# Altium schematic sheet EPS.SchDoc: EPS
size A4; Revision: 1.0; SheetNumber: 1; SheetTotal: 1; Class: A
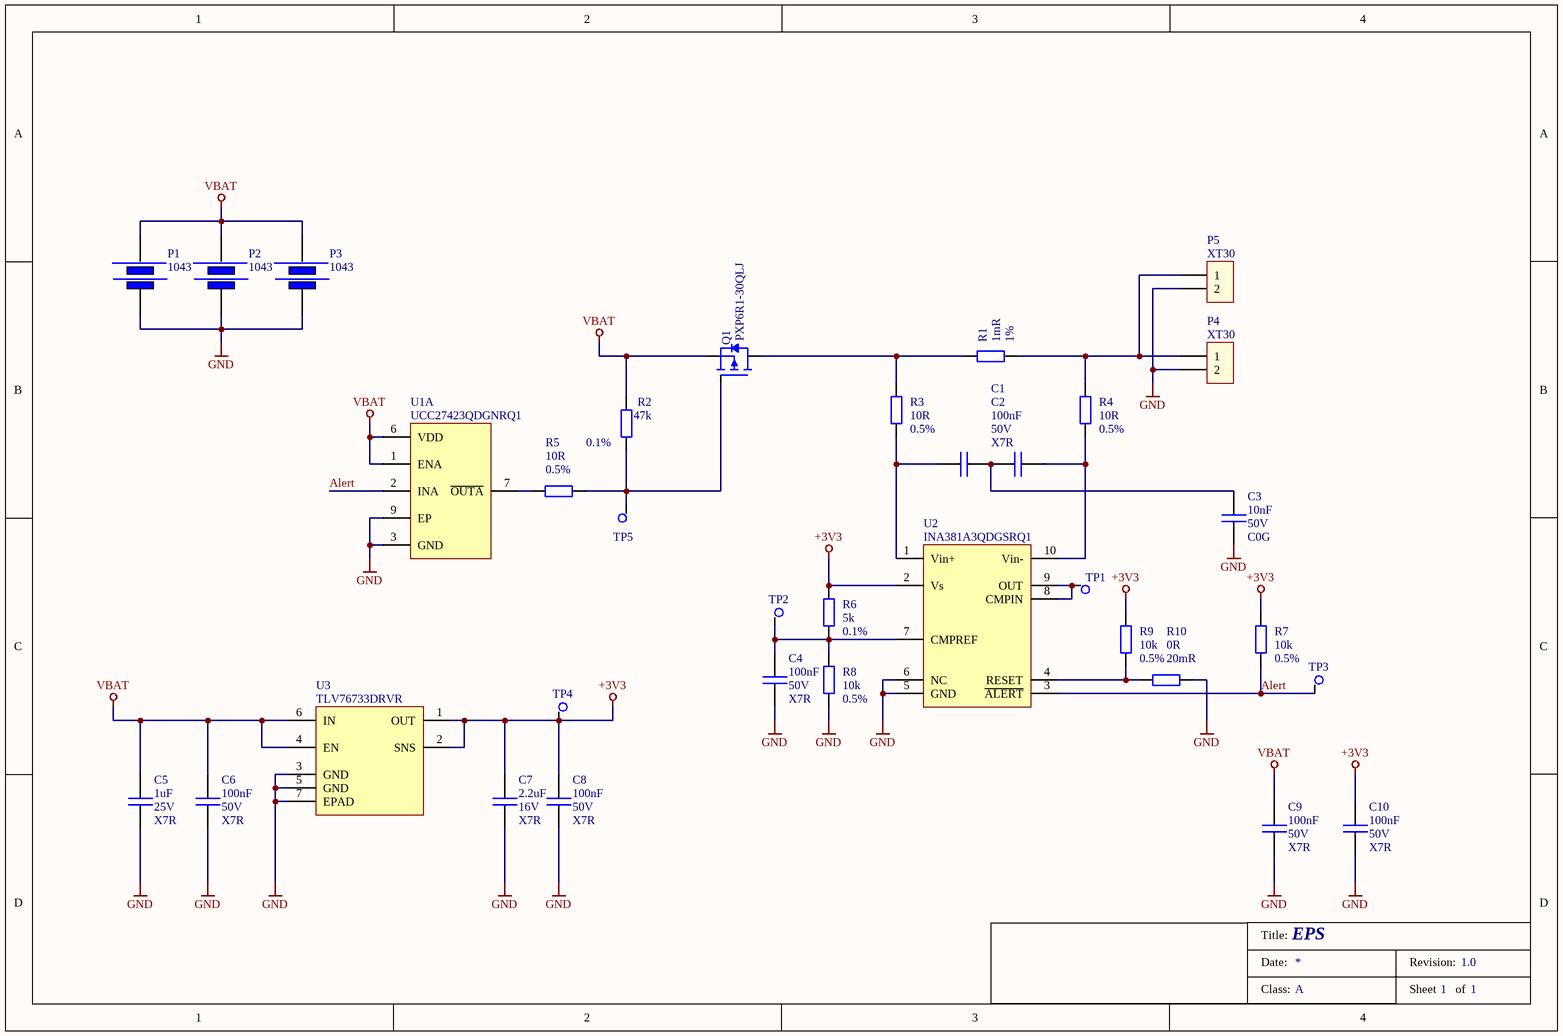
[diagram p0: EPS.SchDoc]

## Parts
C1  C  [C_0603]  (value not drawn)
C2  value 100nF  Voltage: 50V  Dielectric: X7R  [C_0603]  (hidden comment: C)
C3  value 10nF  Voltage: 50V  Dielectric: C0G  [C_0603]  (hidden comment: C)
C4  value 100nF  Voltage: 50V  Dielectric: X7R  [C_0603]  (hidden comment: C)
C5  value 1uF  Voltage: 25V  Dielectric: X7R  [C_0603]  (hidden comment: C)
C6  value 100nF  Voltage: 50V  Dielectric: X7R  [C_0603]  (hidden comment: C)
C7  value 2.2uF  Voltage: 16V  Dielectric: X7R  [C_0805]  (hidden comment: C)
C8  value 100nF  Voltage: 50V  Dielectric: X7R  [C_0603]  (hidden comment: C)
C9  value 100nF  Voltage: 50V  Dielectric: X7R  [C_0603]  (hidden comment: C)
C10  value 100nF  Voltage: 50V  Dielectric: X7R  [C_0603]  (hidden comment: C)
P1  value 1043  [B_1043]  (hidden comment: P_BATT)
P2  value 1043  [B_1043]  (hidden comment: P_BATT)
P3  value 1043  [B_1043]  (hidden comment: P_BATT)
P4  P_Header_2  [XT30]  (value not drawn)
P5  P_Header_2  [XT30]  (value not drawn)
Q1  value PXP6R1-30QLJ  [WDFN_8]  (hidden comment: Q_PMOSFET)
R1  value 1mR  Tolerance: 1%  [R_1206]  (hidden comment: R)
R2  value 47k  Tolerance: 0.1%  [R_0402]  (hidden comment: R)
R3  value 10R  Tolerance: 0.5%  [R_0603]  (hidden comment: R)
R4  value 10R  Tolerance: 0.5%  [R_0603]  (hidden comment: R)
R5  value 10R  Tolerance: 0.5%  [R_0603]  (hidden comment: R)
R6  value 5k  Tolerance: 0.1%  [R_0603]  (hidden comment: R)
R7  value 10k  Tolerance: 0.5%  [R_0603]  (hidden comment: R)
R8  value 10k  Tolerance: 0.5%  [R_0603]  (hidden comment: R)
R9  value 10k  Tolerance: 0.5%  [R_0603]  (hidden comment: R)
R10  value 0R  Tolerance: 20mR  [R_0603]  (hidden comment: R)
TP1  TP_TestPoint  [TP_01]  (value not drawn)
TP2  TP_TestPoint  [TP_01]  (value not drawn)
TP3  TP_TestPoint  [TP_01]  (value not drawn)
TP4  TP_TestPoint  [TP_01]  (value not drawn)
TP5  TP_TestPoint  [TP_01]  (value not drawn)
U1  value UCC27423QDGNRQ1  [MSOP_8]  (hidden comment: IC_UCC27423_Q1)  (part A of 2)
U2  value INA381A3QDGSRQ1  [VSSOP_10]  (hidden comment: IC_INA381_Q1)
U3  =Value: TLV76733DRVR  [WSON_6]  (hidden comment: IC_TLV76733DRVR)

## Nets
+3V3: C7.1 C8.1 C10.1 R6.1 R7.1 R9.1 TP4.1 U2.2(Vs) U3.1(OUT) U3.2(SNS)
GND: C3.2 C4.2 C5.2 C6.2 C7.2 C8.2 C9.2 C10.2 P1.2 P2.2 P3.2 P4.2 P5.2 R8.2 R10.2 U1.3(GND) U1.9(EP) U2.5(GND) U2.6(NC) U3.3(GND) U3.5(GND) U3.7(EPAD)
VBAT: C5.1 C6.1 C9.1 P1.1 P2.1 P3.1 Q1.2(S) R2.1 U1.1(ENA) U1.6(VDD) U3.4(EN) U3.6(IN)
Alert: R7.2 TP3.1 U1.2(INA) U2.3(~{ALERT})
NetC1_1: C1.1 C2.2 C3.1
NetC1_2: C1.2 R4.2 U2.10(Vin-)
NetC2_1: C2.1 R3.2 U2.1(Vin+)
NetC4_1: C4.1 R6.2 R8.1 TP2.1 U2.7(CMPREF)
NetP4_1: P4.1 P5.1 R1.2 R4.1
NetQ1_1: Q1.1(G) R2.2 R5.2 TP5.1
NetQ1_3: Q1.3(D) R1.1 R3.1
NetR5_1: R5.1 U1.7(~{OUTA})
NetR9_2: R9.2 R10.1 U2.4(RESET)
NetTP1_1: TP1.1 U2.8(CMPIN) U2.9(OUT)

## Notes on the sheet
- Title:
- Date:
- Revision:
- Class:
- Sheet
- of

## Library data of the parts
C1 = C_100nF_50V_0603: Capacitor; Manufacturer: Kemet; Manufacturer Part Number: C0603T104K5RCL7136; Voltage: 50V; Dielectric: X7R; Value: 100nF; Tmax: 125; Tmin: -55; Grade: 2; Fail Rate: A; Tolerance: 10%; Part Number: C_100nF_50V_0603; HelpURL: https://content.kemet.com/datasheets/KEM_C1027_X7R_COTS_SMD.pdf; Supplier 1: Digi-Key; Supplier Part Number 1: 399-6305-1-ND; Status: Active
C2 C4 C6 C8-C10 = C_100nF_50V_0603: Capacitor; Manufacturer: Kemet; Manufacturer Part Number: C0603T104K5RCL7136; Tmax: 125; Tmin: -55; Grade: 2; Fail Rate: A; Tolerance: 10%; Part Number: C_100nF_50V_0603; HelpURL: https://content.kemet.com/datasheets/KEM_C1027_X7R_COTS_SMD.pdf; Supplier 1: Digi-Key; Supplier Part Number 1: 399-6305-1-ND; Status: Active
C3 = C_10nF_50V_0603: Capacitor; Manufacturer: Kemet; Manufacturer Part Number: C0603T103J5RAC7867; Tmax: 125; Tmin: -55; Grade: 2; Fail Rate: A; Tolerance: 5%; Part Number: C_10nF_50V_0603; HelpURL: https://content.kemet.com/datasheets/KEM_C1027_X7R_COTS_SMD.pdf; Supplier 1: Digi-Key; Supplier Part Number 1: 399-20387-1-ND; Status: Active
C5 = C_1uF_25V_0603: Capacitor; Manufacturer: Murata; Manufacturer Part Number: C0603T222K5RAC7867 / GCJ188R71E105KA01D; Tmax: 125; Tmin: -55; Grade: 2; Fail Rate: A; Tolerance: 10%; Part Number: C_1uF_25V_0603; HelpURL: https://www.murata.com/en-eu/api/pdfdownloadapi?cate=luCeramicCapacitorsSMD&partno=GCJ188R71E105KA01%23; Supplier 1: Mouser; Supplier Part Number 1: 81-GCJ188R71E105KA1D; Status: Active
C7 = C_2.2uF_16V_0805: Capacitor; Manufacturer: Kemet; Manufacturer Part Number: C0805T225K4RAL7800; Tmax: 125; Tmin: -55; Grade: 2; Fail Rate: A; Tolerance: 10%; Part Number: C_2.2uF_16V_0805; HelpURL: https://content.kemet.com/datasheets/KEM_C1027_X7R_COTS_SMD.pdf; Supplier 1: Digi-Key; Supplier Part Number 1: 399-17975-6-ND; Status: Active
P1-P3 = 18650_Holder_1043: 1043; Manufacturer: Keystone Electronics; Grade: 3; Part Number: 18650_Holder_1043; HelpURL: https://www.keyelco.com/userAssets/file/M65p27.pdf; Manufacturer Part Number: 1043; Supplier 1: Mouser; Supplier Part Number 1: 534-1043; Status: Active
P4 P5 = XT30: Manufacturer: DFRobot; Manufacturer Part Number: FIT0586; Grade: 3; Value: XT30; Desc: XT30; Part Number: XT30; HelpURL: https://media.digikey.com/pdf/Data%20Sheets/DFRobot%20PDFs/FIT0586_Web.pdf; Supplier 1: DigiKey; Supplier Part Number 1: 1738-1436-ND; Status: Active
Q1 = PXP6R1-30QLJ: Low Vgs Single P-Channel; Manufacturer: NEXPERIA; Max Power Dissipation: 50W; Tmax: 150; Tmin: -55; Grade: 2; Part Number: PXP6R1-30QLJ; HelpURL: https://assets.nexperia.com/documents/data-sheet/PXP6R1-30QL.pdf; Manufacturer Part Number: PXP6R1-30QLJ; Supplier 1: Mouser; Supplier Part Number 1: 771-PXP6R1-30QLJ; Status: Active
R1 = R_1mR_NA_1206: Manufacturer: TT Electronics; Manufacturer Part Number: ULRG1-1206-R001-F-LF-SLT / ULRG1-1206-R001-F-LF-SLT; Voltage: NA; RMS Power: 1W; TCR: 50ppm; Tmax: 170; Tmin: -55; Grade: 2; Part Number: R_1mR_NA_1206; HelpURL: https://www.ttelectronics.com/TTElectronics/media/ProductFiles/Datasheets/ULR.pdf; Supplier 1: Mouser; Supplier Part Number 1: 66-ULRG1-1206-R001F; Status: Active
R2 = R_47k_50V_0402: Manufacturer: Vishay; Manufacturer Part Number: MCS0402MD4702BE100; Voltage: 50V; RMS Power: 0.1W; TCR: 25ppm; Tmax: 155; Tmin: -55; Grade: 2; Part Number: R_47k_50V_0402; HelpURL: https://www.vishay.com/docs/28785/mcat_pre.pdf; Supplier 2: Mouser; Supplier Part Number 2: 594-MCS0402MD4702BE1; Supplier 1: Digi-Key; Supplier Part Number 1: MCS0402-47.0K-MBCT-ND; Status: Active
R3-R5 = R_10R_75V_0603: Manufacturer: Vishay; Manufacturer Part Number: MCT0603PD1009DP500; Voltage: 75V; RMS Power: 0.25W; TCR: 25ppm; Tmax: 175; Tmin: -55; Grade: 2; Part Number: R_10R_75V_0603; HelpURL: https://www.vishay.com/docs/28916/mcxhp.pdf; Supplier 2: Mouser; Supplier Part Number 2: 594-MCT0603PD1009DP5; Supplier 1: Digi-Key; Supplier Part Number 1: 749-1520-1-ND; Status: Active
R6 = R_5k_75V_0603: Manufacturer: YAGEO; Manufacturer Part Number: RT0603BRE075KL; Voltage: 75V; RMS Power: 0.1W; TCR: 50ppm; Tmax: 155; Tmin: -55; Grade: 2; Part Number: R_5k_75V_0603; HelpURL: https://www.yageo.com/upload/media/product/productsearch/datasheet/rchip/PYu-RT_1-to-0.01_RoHS_L_13.pdf; Supplier 1: Mouser; Supplier Part Number 1: 603-RT0603BRE075KL; Status: Active
R7-R9 = R_10k_75V_0603: Manufacturer: Vishay; Manufacturer Part Number: MCT0603PD1002DP500; Voltage: 75V; RMS Power: 0.25W; TCR: 25ppm; Tmax: 175; Tmin: -55; Grade: 2; Part Number: R_10k_75V_0603; HelpURL: https://www.vishay.com/docs/28916/mcxhp.pdf; Supplier 2: Mouser; Supplier Part Number 2: 594-MCT0603PD1002DP5; Supplier 1: Digi-Key; Supplier Part Number 1: 749-1528-1-ND; Status: Active
R10 = R_0R_75V_0603: Manufacturer: Vishay; Manufacturer Part Number: MCT0603MZ0000ZP500; Voltage: 75V; Current: 1A; Tmax: 155; Tmin: -55; Grade: 2; Part Number: R_0R_75V_0603; HelpURL: https://www.vishay.com/docs/28760/mcat_pro.pdf; Supplier 2: Mouser; Supplier Part Number 2: 594-MCT0603MZ0000ZP5; Supplier 1: Digi-Key; Supplier Part Number 1: 749-1745-1-ND; Status: Active
TP1-TP5 = TestPoint1: Manufacturer: Progresja Space; Value: TP; Grade: 3; Part Number: TestPoint1; Status: Active
U1 = UCC27423: Dual 4-A High-Speed Low-Side MOSFET Drivers With Enable; Manufacturer: TI; Tmax: 125; Tmin: -40; Grade: 2; Part Number: UCC27423; HelpURL: https://www.ti.com/lit/ds/symlink/ucc27423-q1.pdf?HQS=dis-mous-null-mousermode-dsf-pf-null-wwe&ts=1651498832882&ref_url=https%253A%252F%252Fwww.mouser.pl%252F; Manufacturer Part Number: UCC27423QDGNRQ1; Supplier 1: Mouser; Supplier Part Number 1: 595-UCC27423QDGNRQ1; Status: Active
U2 = INA381A3QDGSRQ1: Current Sense Amplifier With Integrated Overcurrent Comparator; Manufacturer: TI; Tmax: 125; Tmin: -40; Grade: 2; Part Number: INA381A3QDGSRQ1; HelpURL: https://www.ti.com/lit/ds/symlink/ina381-q1.pdf; Manufacturer Part Number: INA381A3QDGSRQ1; Supplier 1: Mouser; Supplier Part Number 1: 595-INA381A3QDGSRQ1; Status: Active
U3 = TLV76733DRVR: 3.3V LDO Voltage Regulator; Manufacturer: TI; Tmax: 125; Tmin: -40; Grade: 2; Part Number: TLV76733DRVR; Value: TLV76733DRVR; HelpURL: https://www.ti.com/lit/ds/symlink/tlv767.pdf?ts=1677533353578&ref_url=https%253A%252F%252Fwww.ti.com%252Fproduct%252FTLV767%252Fpart-details%252FTLV76733DRVR; Manufacturer Part Number: TLV76733DRVR; Supplier 2: Mouser; Supplier Part Number 2: 595-TLV76733DRVR; Status: Active